# EAGLE schematic adapter (EAGLE 7.1.0)
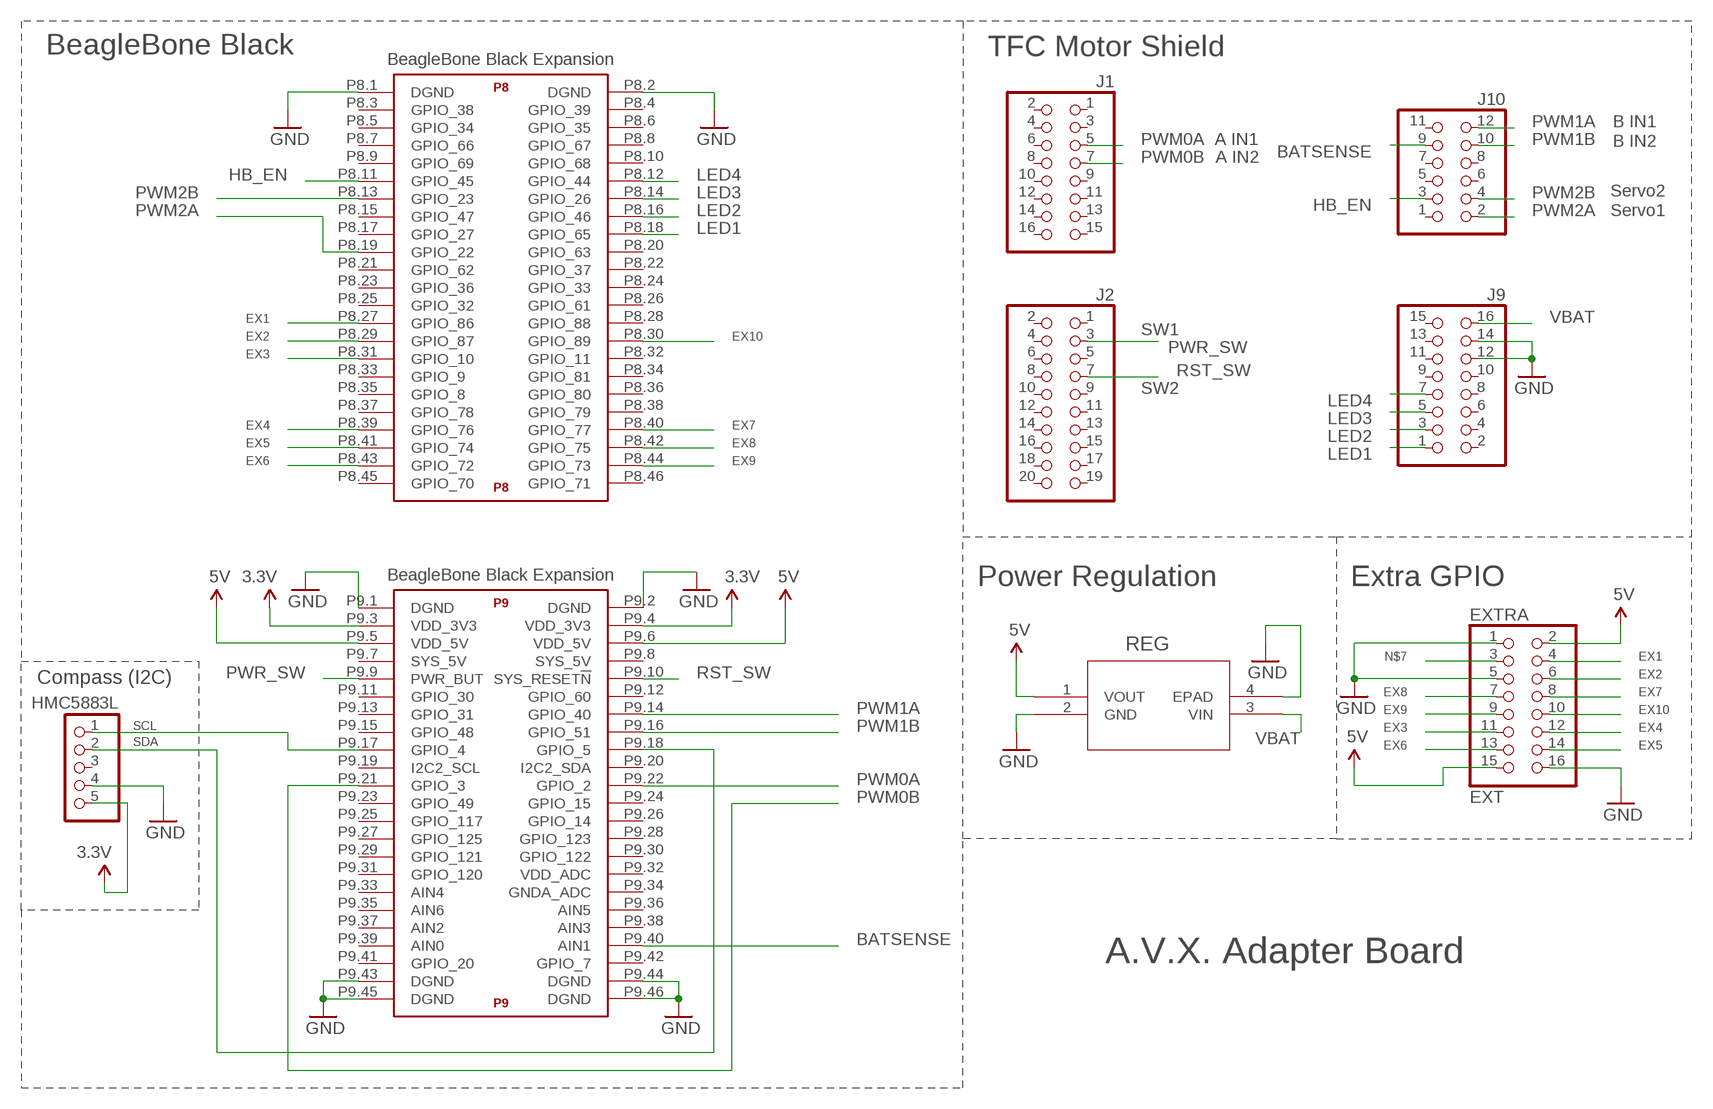
[diagram p0: schematic, sheet 1]

## Parts
COMPASS  HMC5883L  PINHD-1X5  [1X05]
EXTRA  EXT  PINHD-2X8  [2X08]
J1  PINHD-2X8  [2X08]
J2  PINHD-2X10  [2X10]
J9  PINHD-2X8  [2X08]
J10  PINHD-2X6  [2X06]
REG  UCC383-5_KTT_3  [KTT3_6P22X6P6]
U$1  BEAGLE_BONE_BLACK_CAPE  [BEAGLE_BONE_BLACK_CAPE]

## Nets
3.3V: COMPASS.5 U$1.P9.3(P9:VDD_3V3) U$1.P9.4(P9:VDD_3V3)
5V: EXTRA.2 EXTRA.15 REG.1(VOUT) U$1.P9.5(P9:VDD_5V) U$1.P9.6(P9:VDD_5V)
BATSENSE: J10.9 U$1.P9.40(P9:AIN1)
EX1: EXTRA.4 U$1.P8.27(P8:GPIO_86)
EX2: EXTRA.6 U$1.P8.29(P8:GPIO_87)
EX3: EXTRA.11 U$1.P8.31(P8:GPIO_10)
EX4: EXTRA.12 U$1.P8.39(P8:GPIO_76)
EX5: EXTRA.14 U$1.P8.41(P8:GPIO_74)
EX6: EXTRA.13 U$1.P8.43(P8:GPIO_72)
EX7: EXTRA.8 U$1.P8.40(P8:GPIO_77)
EX8: EXTRA.7 U$1.P8.42(P8:GPIO_75)
EX9: EXTRA.9 U$1.P8.44(P8:GPIO_73)
EX10: EXTRA.10 U$1.P8.30(P8:GPIO_89)
GND: COMPASS.4 EXTRA.1 EXTRA.5 EXTRA.16 J9.12 J9.14 REG.2(GND) REG.4(EPAD) U$1.P8.1(P8:DGND) U$1.P8.2(P8:DGND) U$1.P9.1(P9:DGND) U$1.P9.2(P9:DGND) U$1.P9.43(P9:DGND) U$1.P9.44(P9:DGND) U$1.P9.45(P9:DGND) U$1.P9.46(P9:DGND)
HB_EN: J10.3 U$1.P8.11(P8:GPIO_45)
I2C1_SCL: COMPASS.1 U$1.P9.17(P9:GPIO_4)
I2C1_SDA: COMPASS.2 U$1.P9.18(P9:GPIO_5)
LED1: J9.1 U$1.P8.18(P8:GPIO_65)
LED2: J9.3 U$1.P8.16(P8:GPIO_46)
LED3: J9.5 U$1.P8.14(P8:GPIO_26)
LED4: J9.7 U$1.P8.12(P8:GPIO_44)
N$7: EXTRA.3
PWM0A: J1.5 U$1.P9.22(P9:GPIO_2)
PWM0B: J1.7 U$1.P9.21(P9:GPIO_3)
PWM1A: J10.12 U$1.P9.14(P9:GPIO_40)
PWM1B: J10.10 U$1.P9.16(P9:GPIO_51)
PWM2A: J10.2 U$1.P8.19(P8:GPIO_22)
PWM2B: J10.4 U$1.P8.13(P8:GPIO_23)
PWR_SW: J2.3 U$1.P9.9(P9:PWR_BUT)
RST_SW: J2.7 U$1.P9.10(P9:SYS_RESET!N)
VBAT: J9.16 REG.3(VIN)
Unconnected: COMPASS.3 J1.1 J1.2 J1.3 J1.4 J1.6 J1.8 J1.9 J1.10 J1.11 J1.12 J1.13 J1.14 J1.15 J1.16 J2.1 J2.2 J2.4 J2.5 J2.6 J2.8 J2.9 J2.10 J2.11 J2.12 J2.13 J2.14 J2.15 J2.16 J2.17 J2.18 J2.19 J2.20 J9.2 J9.4 J9.6 J9.8 J9.9 J9.10 J9.11 J9.13 J9.15 J10.1 J10.5 J10.6 J10.7 J10.8 J10.11 U$1.P8.3(P8:GPIO_38) U$1.P8.4(P8:GPIO_39) U$1.P8.5(P8:GPIO_34) U$1.P8.6(P8:GPIO_35) U$1.P8.7(P8:GPIO_66) U$1.P8.8(P8:GPIO_67) U$1.P8.9(P8:GPIO_69) U$1.P8.10(P8:GPIO_68) U$1.P8.15(P8:GPIO_47) U$1.P8.17(P8:GPIO_27) U$1.P8.20(P8:GPIO_63) U$1.P8.21(P8:GPIO_62) U$1.P8.22(P8:GPIO_37) U$1.P8.23(P8:GPIO_36) U$1.P8.24(P8:GPIO_33) U$1.P8.25(P8:GPIO_32) U$1.P8.26(P8:GPIO_61) U$1.P8.28(P8:GPIO_88) U$1.P8.32(P8:GPIO_11) U$1.P8.33(P8:GPIO_9) U$1.P8.34(P8:GPIO_81) U$1.P8.35(P8:GPIO_8) U$1.P8.36(P8:GPIO_80) U$1.P8.37(P8:GPIO_78) U$1.P8.38(P8:GPIO_79) U$1.P8.45(P8:GPIO_70) U$1.P8.46(P8:GPIO_71) U$1.P9.7(P9:SYS_5V) U$1.P9.8(P9:SYS_5V) U$1.P9.11(P9:GPIO_30) U$1.P9.12(P9:GPIO_60) U$1.P9.13(P9:GPIO_31) U$1.P9.15(P9:GPIO_48) U$1.P9.19(P9:I2C2_SCL) U$1.P9.20(P9:I2C2_SDA) U$1.P9.23(P9:GPIO_49) U$1.P9.24(P9:GPIO_15) U$1.P9.25(P9:GPIO_117) U$1.P9.26(P9:GPIO_14) U$1.P9.27(P9:GPIO_125) U$1.P9.28(P9:GPIO_123) U$1.P9.29(P9:GPIO_121) U$1.P9.30(P9:GPIO_122) U$1.P9.31(P9:GPIO_120) U$1.P9.32(P9:VDD_ADC) U$1.P9.33(P9:AIN4) U$1.P9.34(P9:GNDA_ADC) U$1.P9.35(P9:AIN6) U$1.P9.36(P9:AIN5) U$1.P9.37(P9:AIN2) U$1.P9.38(P9:AIN3) U$1.P9.39(P9:AIN0) U$1.P9.41(P9:GPIO_20) U$1.P9.42(P9:GPIO_7)

## Notes on the sheet
- BeagleBone Black | TFC Motor Shield
- BeagleBone Black Expansion
- B IN1
- B IN2
- A IN1
- A IN2
- Servo2
- Servo1
- SW1
- SW2
- BeagleBone Black Expansion
- Power Regulation | Extra GPIO
- Compass (I2C)
- SCL
- SDA
- A.V.X. Adapter Board

## Library data of the parts
COMPASS = pinhead:PINHD-1X5: PIN HEADER
EXTRA J1 J9 = pinhead:PINHD-2X8: PIN HEADER
J2 = pinhead:PINHD-2X10: PIN HEADER
J10 = pinhead:PINHD-2X6: PIN HEADER
REG = TI_UCC:UCC383-5_KTT_3; DATASHEETURL: http://www.ti.com/lit/gpn/UCC383-5; DESCRIPTION: Single Output LDO, 3.0A, Fixed(5.0V), Reverse Current Protection, Thermal Shutdown; FAMILY_NAME: SINGLE CHANNEL LDO; GENERIC_PART_NUMBER: UCC383-5; INDUSTRY_STD_PKG_TYPE: DDPAK/TO-263; MANUFACTURER: Texas Instruments; MANUFACTURER_PART_NUMBER: ucc383-5_ktt_3; PACKAGE_DESIGNATOR: KTT; PIN_COUNT: 3; VENDOR: Texas Instruments
U$1 = bbb:BEAGLE_BONE_BLACK_CAPE